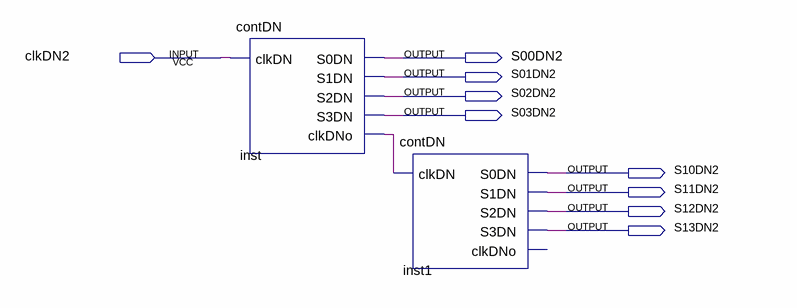
[diagram p0: schematic sheet]
// Quartus schematic contDN2.bdf as structural Verilog: 2 symbols, 9 pins
module contDN2 (
  input  clkDN2,
  output S00DN2,
  output S01DN2,
  output S02DN2,
  output S03DN2,
  output S10DN2,
  output S11DN2,
  output S12DN2,
  output S13DN2
);

  wire inst_clkdno;

  contDN inst (.clkDN(clkDN2), .S0DN(S00DN2), .S1DN(S01DN2), .S2DN(S02DN2), .S3DN(S03DN2), .clkDNo(inst_clkdno));
  contDN inst1 (.clkDN(inst_clkdno), .S0DN(S10DN2), .S1DN(S11DN2), .S2DN(S12DN2), .S3DN(S13DN2));  // open: clkDNo
endmodule
